# EAGLE design devboard (EAGLE 7.3.0)
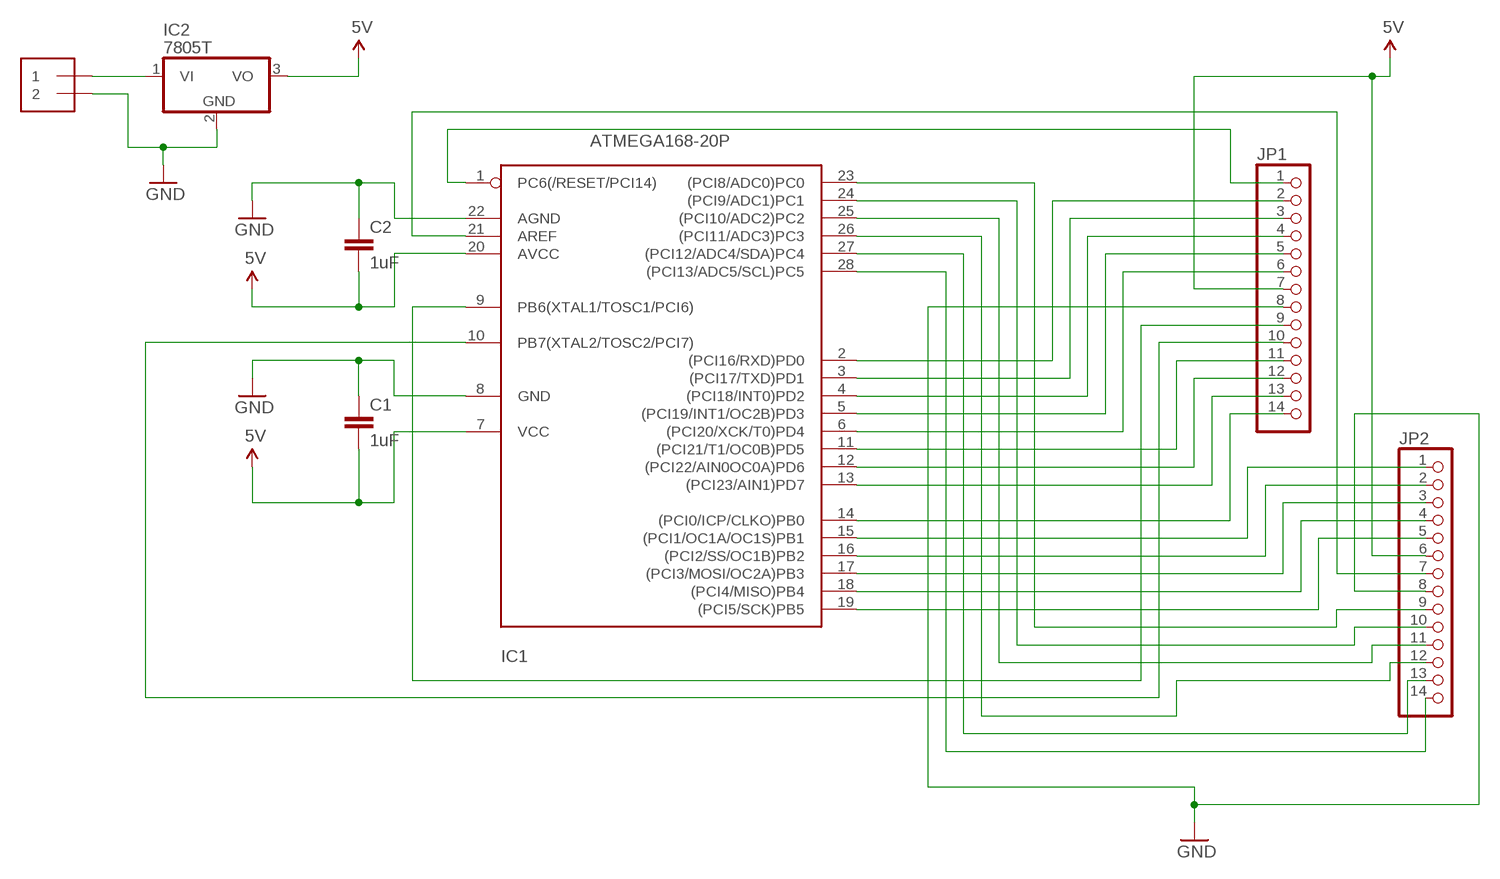
[diagram p0: schematic, sheet 1]

## Parts
C1  1uF  CAPPTH  [CAP-PTH-SMALL]
C2  1uF  CAPPTH  [CAP-PTH-SMALL]
IC1  ATMEGA168-20P  [DIL28-3]
IC2  7805T  [TO220H]
JP1  PINHD-1X14  [1X14]
JP2  PINHD-1X14  [1X14]
POWER_IN  1X2-3.5MM  [1X2-3.5MM]

## Nets
GND [supply]: C1.1 C2.1 IC1.8(GND) IC1.22(AGND) IC2.2(GND) JP1.8 JP2.8 POWER_IN.2
MISO: IC1.18((PCI4/MISO)PB4) JP2.4
MOSI: IC1.17((PCI3/MOSI/OC2A)PB3) JP2.3
N$1: IC1.1(PC6(/RESET/PCI14)) JP1.1
PIN2: IC1.2((PCI16/RXD)PD0) JP1.2
PIN3: IC1.3((PCI17/TXD)PD1) JP1.3
PIN4: IC1.4((PCI18/INT0)PD2) JP1.4
PIN5: IC1.5((PCI19/INT1/OC2B)PD3) JP1.5
PIN6: IC1.6((PCI20/XCK/T0)PD4) JP1.6
PIN9: IC1.9(PB6(XTAL1/TOSC1/PCI6)) JP1.9
PIN10: IC1.10(PB7(XTAL2/TOSC2/PCI7)) JP1.10
PIN11: IC1.11((PCI21/T1/OC0B)PD5) JP1.11
PIN12: IC1.12((PCI22/AIN0OC0A)PD6) JP1.12
PIN13: IC1.13((PCI23/AIN1)PD7) JP1.13
PIN14: IC1.14((PCI0/ICP/CLKO)PB0) JP1.14
PIN15: IC1.15((PCI1/OC1A/OC1S)PB1) JP2.1
PIN16: IC1.16((PCI2/SS/OC1B)PB2) JP2.2
PIN21: IC1.21(AREF) JP2.7
PIN23: IC1.23((PCI8/ADC0)PC0) JP2.9
PIN24: IC1.24((PCI9/ADC1)PC1) JP2.10
PIN25: IC1.25((PCI10/ADC2)PC2) JP2.11
PIN26: IC1.26((PCI11/ADC3)PC3) JP2.12
PIN27: IC1.27((PCI12/ADC4/SDA)PC4) JP2.13
PIN28: IC1.28((PCI13/ADC5/SCL)PC5) JP2.14
SCK: IC1.19((PCI5/SCK)PB5) JP2.5
VCC [supply]: C1.2 C2.2 IC1.7(VCC) IC1.20(AVCC) IC2.3(VO) JP1.7 JP2.6 ; supply symbol labelled 5V
VIN [supply]: IC2.1(VI) POWER_IN.1

## Library data of the parts
C1 C2 = SparkFun-Capacitors:CAP: Capacitor Standard 0603 ceramic capacitor, and 0.1" leaded capacitor.
IC1 = adafruit:ATMEGA168*P: MICROCONTROLLER 16 kBytes FLASH 1 kBytes SRAM 512 Bytes EEPROM USART 8-channel 10 bit ADC
IC2 = adafruit:78*: Positive VOLTAGE REGULATOR Added bigger pads to the TO-92 package
JP1 JP2 = adafruit:PINHD-1X14: PIN HEADER
POWER_IN = adafruit:1X2: 3.5mm Terminal block http://www.ladyada.net/library/pcb/eaglelibrary.html

## Net classes
0 default: width 0.254 mm, clearance 0.254 mm
1 supply: width 0.508 mm, clearance 0.508 mm

## Board
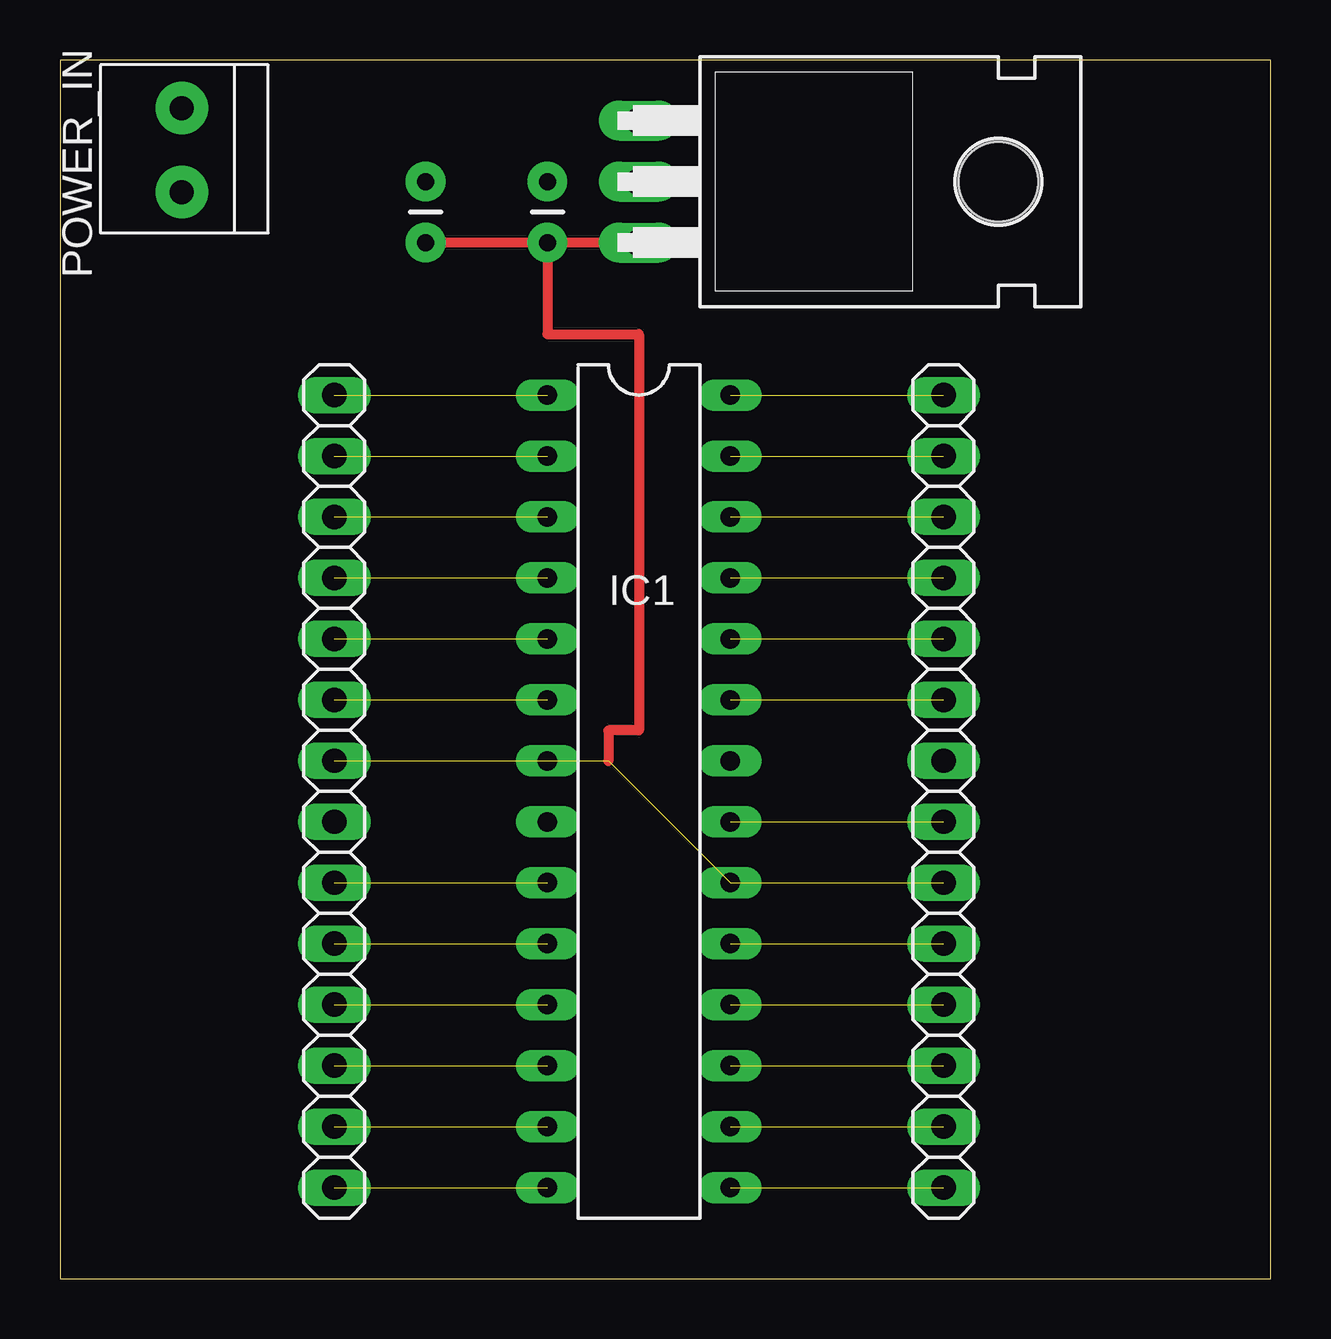
[diagram p1: board, top side]
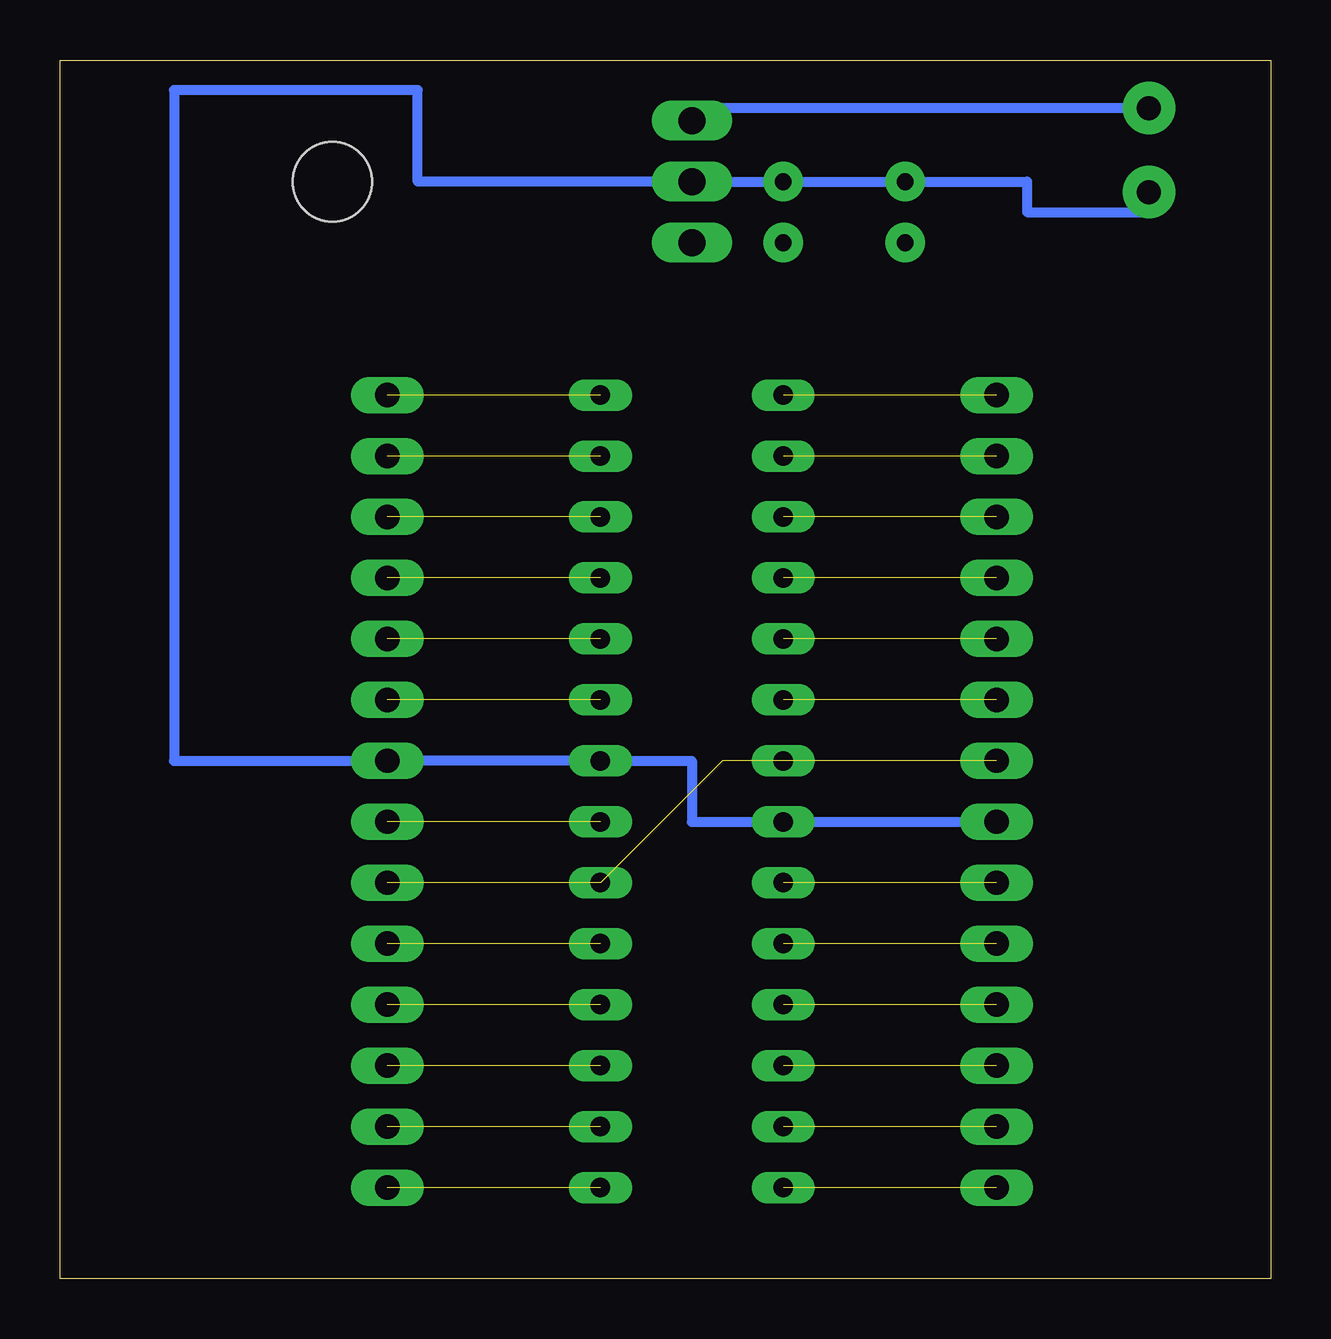
[diagram p2: board, bottom side, seen from below]

Size 50.47 x 50.79 mm. Coordinates in mm from the lower left corner, seen from the top.
Outline: 0,0 50.47,0 50.47,50.79 0,50.79 0,0
Copper layers (1*16): Top 0.035mm / dielectric 1.5mm / Bottom 0.035mm
Design rules "default": minimum track width 10mil, minimum drill 24mil, track to track 8mil, track to pad 8mil, pad to pad 8mil, via to via 8mil, smd to smd 8mil, copper to edge 40mil, drill to drill 8mil, minimum pad ring 10mil, minimum via ring 8mil, stop-mask expansion 4mil, vias tented up to drill 0mil, thermal gap 10mil

### Footprints (pad centres in the part's own frame; a part is rotated, then mirrored left to right if it is on the bottom)
CAP-PTH-SMALL = drill 0.7 pad 1.651: 1 0,0; 2 2.54,0
DIL28-3 = drill 0.813 long: 1 -16.51,-3.81; 2 -13.97,-3.81; 3 -11.43,-3.81; 4 -8.89,-3.81; 5 -6.35,-3.81; 6 -3.81,-3.81; 7 -1.27,-3.81; 8 1.27,-3.81; 9 3.81,-3.81; 10 6.35,-3.81; 11 8.89,-3.81; 12 11.43,-3.81; 13 13.97,-3.81; 14 16.51,-3.81; 15 16.51,3.81; 16 13.97,3.81; 17 11.43,3.81; 18 8.89,3.81; 19 6.35,3.81; 20 3.81,3.81; 21 1.27,3.81; 22 -1.27,3.81; 23 -3.81,3.81; 24 -6.35,3.81; 25 -8.89,3.81; 26 -11.43,3.81; 27 -13.97,3.81; 28 -16.51,3.81
TO220H = drill 1.118 long: 1 -2.54,-10.16; 2 0,-10.16; 3 2.54,-10.16 | hole 3.302: 0,4.826
1X14 = drill 1.016 long: 1 -16.51,0; 2 -13.97,0; 3 -11.43,0; 4 -8.89,0; 5 -6.35,0; 6 -3.81,0; 7 -1.27,0; 8 1.27,0; 9 3.81,0; 10 6.35,0; 11 8.89,0; 12 11.43,0; 13 13.97,0; 14 16.51,0
1X2-3.5MM = drill 1 pad 2.184: 1 1.8,0; 2 -1.7,0

### Placement (x,y rotation side)
C1  20.32,45.72 270 top
C2  15.24,45.72 270 top
IC1  24.13,20.32 270 top
IC2  34.29,45.72 270 top
JP1  11.43,20.32 270 top
JP2  36.83,20.32 90 top
POWER_IN  5.08,46.99 90 top

### Tracks (layer width: path | path; a pad name or v marks a point on that pad's centre or on a via)
GND
  Bottom 0.406: JP1.8 IC1.8 24.13,19.05 24.13,21.59 IC1.22 JP2.8 45.72,21.59 45.72,49.53 35.56,49.53 35.56,45.72 IC2.2 C1.1 C2.1 10.16,45.72 10.16,44.45 5.08,44.45 POWER_IN.2
MISO  (1 unrouted)
MOSI  (1 unrouted)
N$1  (1 unrouted)
PIN2  (1 unrouted)
PIN3  (1 unrouted)
PIN4  (1 unrouted)
PIN5  (1 unrouted)
PIN6  (1 unrouted)
PIN9  (1 unrouted)
PIN10  (1 unrouted)
PIN11  (1 unrouted)
PIN12  (1 unrouted)
PIN13  (1 unrouted)
PIN14  (1 unrouted)
PIN15  (1 unrouted)
PIN16  (1 unrouted)
PIN21  (1 unrouted)
PIN23  (1 unrouted)
PIN24  (1 unrouted)
PIN25  (1 unrouted)
PIN26  (1 unrouted)
PIN27  (1 unrouted)
PIN28  (1 unrouted)
SCK  (1 unrouted)
VCC  (4 unrouted)
  Top 0.406: IC2.3 C1.2 | C1.2 C2.2 | C1.2 20.32,39.37 24.13,39.37 24.13,22.86 22.86,22.86 22.86,21.59
VIN
  Bottom 0.406: POWER_IN.1 24.13,48.79 IC2.1

### Text on the board
Document: V IN | GND | 5V | 5V | 5V | GND | GND | G | GND | GND | G | 5V | 5V